# Altium project Receiver.PrjPcb
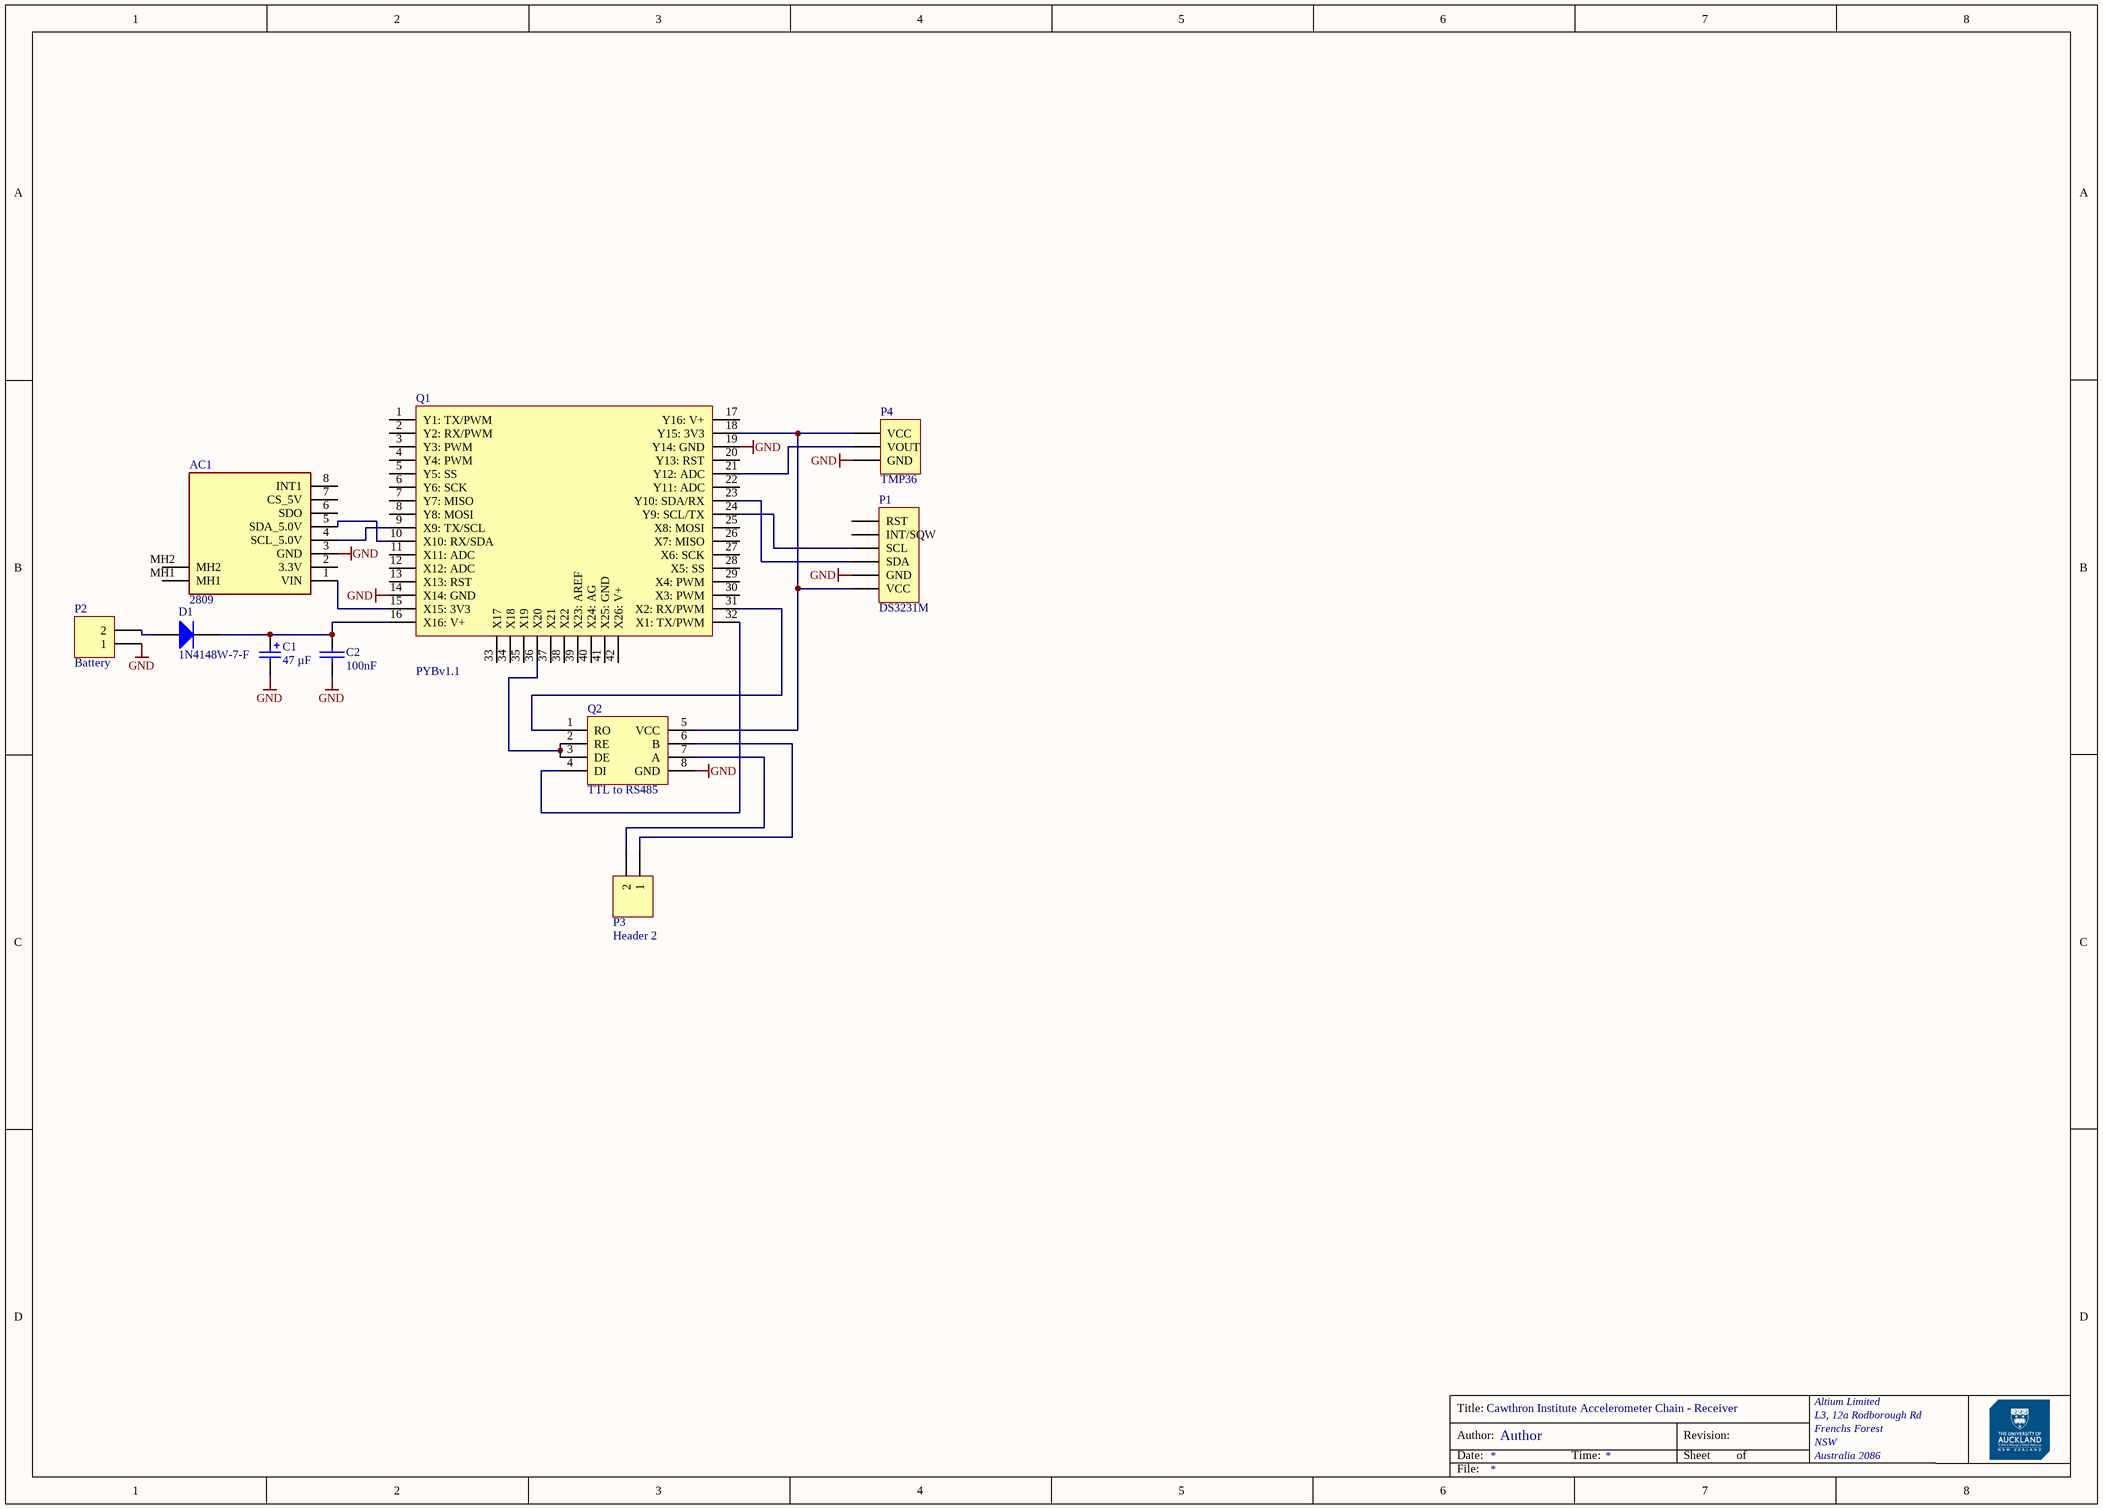
[diagram p0: Sheet1.SchDoc]
1 sheet, 10 parts. Net scope: global (net labels, ports and power ports of the same name join across sheets).
Board files: PCB3.PcbDoc, Receiver_v3.PcbDoc

## Sheet Sheet1.SchDoc
size A3; Author: Author; Organization: Altium Limited; Address1: L3, 12a Rodborough Rd; Address2: Frenchs Forest; Address3: NSW; Address4: Australia 2086

### Parts
AC1  2809  [2809]
C1  Capacitance 1: 47 µF  [CAP POL 8x5.4mm SMT]  (hidden comment: CAP ALUM 22UF 20% 50V SMD)
C2  100nF  [0805 CAP]
D1  1N4148W-7-F  [SOD123]
P1  DS3231M  [HDR1X6]
P2  Battery  [HDR1X2]
P3  Header 2  [HDR1X2]
P4  TMP36  [HDR1X3]
Q1  PYBv1.1  [PCBComponent_1]
Q2  TTL to RS485  [PCBComponent_1]

### Nets
GND: AC1.3(GND) C1.2 C2.2 P1.5(GND) P2.1 P4.3(GND) Q1.14(X14:_GND) Q1.19(Y14:_GND) Q2.8(GND)
NetAC1_1: AC1.1(VIN) Q1.15(X15:_3V3)
NetAC1_4: AC1.4(SCL_5.0V) Q1.9(X9:_TX/SCL)
NetAC1_5: AC1.5(SDA_5.0V) Q1.10(X10:_RX/SDA)
NetC1_1: C1.1 C2.1 D1.2(K) Q1.16(X16:_V+)
NetD1_1: D1.1(A) P2.2
NetP1_3: P1.3(SCL) Q1.24(Y9:_SCL/TX)
NetP1_4: P1.4(SDA) Q1.23(Y10:_SDA/RX)
NetP1_6: P1.6(VCC) P4.1(VCC) Q1.18(Y15:_3V3) Q2.5(VCC)
NetP3_1: P3.1 Q2.6(B)
NetP3_2: P3.2 Q2.7(A)
NetP4_2: P4.2(VOUT) Q1.21(Y12:_ADC)
NetQ1_31: Q1.31(X2:_RX/PWM) Q2.1(RO)
NetQ1_32: Q1.32(X1:_TX/PWM) Q2.4(DI)
NetQ1_36: Q1.36(X20) Q2.2(RE) Q2.3(DE)

Not connected (* = marked no-connect by the designer): AC1 2(3.3V) 6(SDO) 7(CS_5V) 8(INT1) MH1 MH2; P1 1(RST) 2(INT/SQW); Q1 1(Y1:_TX/PWM) 2(Y2:_RX/PWM) 3(Y3:_PWM) 4(Y4:_PWM) 5(Y5:_SS) 6(Y6:_SCK) 7(Y7:_MISO) 8(Y8:_MOSI) 11(X11:_ADC) 12(X12:_ADC) 13(X13:_RST) 17(Y16:_V+) 20(Y13:_RST) 22(Y11:_ADC) 25(X8:_MOSI) 26(X7:_MISO) 27(X6:_SCK) 28(X5:_SS) 29(X4:_PWM) 30(X3:_PWM) 33(X17) 34(X18) 35(X19) 37(X21) 38(X22) 39(X23:_AREF) 40(X24:_AG) 41(X25:_GND) 42(X26:_V+)

### Notes on the sheet
- Cawthron Institute Accelerometer Chain - Receiver
- Title:
- Author:
- Date:
- Time:
- Revision:
- Sheet
- of
- File:

### Library data of the parts
AC1 = 2809: Accelerometer; Manufacturer_Name: Adafruit; Allied_Number: 70929317; Datasheet Link: http://www.mouser.com/datasheet/2/737/adafruit-lis3dh-triple-axis-accelerometer-breakout-780345.pdf; Height: 5mm; Manufacturer_Part_Number: 2809; Mouser Part Number: 485-2809; Mouser Price/Stock: https://www.mouser.com/Search/Refine.aspx?Keyword=485-2809; Allied Price/Stock: https://www.alliedelec.com/adafruitindustries-2809/70929317/
C1 = SMT-CAP 22uF/35V SM: Manufacturer: Nichicon; Manufacturer Part Number: UWX1V220MCL1GB; Lifetime @ Temp.: 2000 Hrs @ 85°C; Polarization: Polar; Surface Mount Land Size: 0.260" L x 0.260" W (6.60mm x 6.60mm); Revision: July-2002: Re-released for DXP Platform.; Supplier 1: Digi-Key; RoHS: RoHS Compliant; Category: Capacitors; Stock 1: 680; Pricing 1: 1=0.59, 10=0.406, 100=0.2304, 500=0.16268 (NZD); Packaging: Cut Tape (CT); Part Status: Active; Tolerance: ±20%; ESR (Equivalent Series Resistance): -; Operating Temperature: -40°C ~ 85°C; Ratings: -; Applications: General Purpose; Lead Spacing: -; Size / Dimension: 0.248" Dia (6.30mm); Height - Seated (Max): 0.213" (5.40mm); Mounting Type: Surface Mount; Package / Case: Radial, Can - SMD; ComponentLink1URL: http://nichicon-us.com/english/products/pdfs/e-uwx.pdf; ComponentLink1Description: http://nichicon-us.com/english/products/pdfs/e-uwx.pdf; Supplier Part Number 1: 493-2118-1-ND
C2 = SMT- Cap: SMT Capacitor Non Polarised; Value: *
D1 = SMT-Diode 1N4148W-7-F: DIODE GEN PURP 100V 300MA SOD123; Manufacturer: Diodes Incorporated; Manufacturer Part Number: 1N4148W-13-F; Diode Type: Standard; Current - Average Rectified (Io): 150mA; Speed: Small Signal =< 200mA (Io), Any Speed; Capacitance @ Vr, F: 2pF @ 0V, 1MHz; Supplier 1: Digi-Key; RoHS: RoHS Compliant; Category: Discrete Semiconductor Products; Stock 1: 5282; Pricing 1: 1=0.33, 10=0.292, 100=0.1586, 500=0.0976, 1000=0.06656 (NZD); Packaging: Cut Tape (CT); Part Status: Active; Mounting Type: Surface Mount; Package / Case: SOD-123; Supplier Device Package: SOD-123; Operating Temperature - Junction: -65°C ~ 150°C; Base Part Number: 1N4148W; ComponentLink1URL: https://www.diodes.com/assets/Datasheets/ds30086.pdf; ComponentLink1Description: https://www.diodes.com/assets/Datasheets/ds30086.pdf; Supplier Part Number 1: 1N4148W-13FDICT-ND
P1 = Header 6: Header, 6-Pin; LatestRevisionDate: 17-Jul-2002; LatestRevisionNote: Re-released for DXP Platform.; Publisher: Altium Limited
P2 P3 = Header 2: Header, 2-Pin; LatestRevisionDate: 17-Jul-2002; LatestRevisionNote: Re-released for DXP Platform.; Publisher: Altium Limited
P4 = Header 3: Header, 3-Pin; LatestRevisionDate: 17-Jul-2002; LatestRevisionNote: Re-released for DXP Platform.; Publisher: Altium Limited
Q1 = PYBv1.1: Microcontroller
Q2 = TTL to RS485: Converter